# Altium schematic sheet 1_HV_POWER.schdoc
size 431 x 309 mm; Symbol: Sheet-Symbol_A3; Device: Sheet-Symbol_A3; @Page Name: HV_POWER copy; @Create Date: 2023-07-31; @Page Count: 4; @Page No: 1; @Project Name: DM lite opensource board A2A V1.0; @Schematic Name: HV582双路模块H7主控 copy; @Update Date: 2023-08-04; Company: 嘉立创EDA; Page Size: A3; Version: V1.0
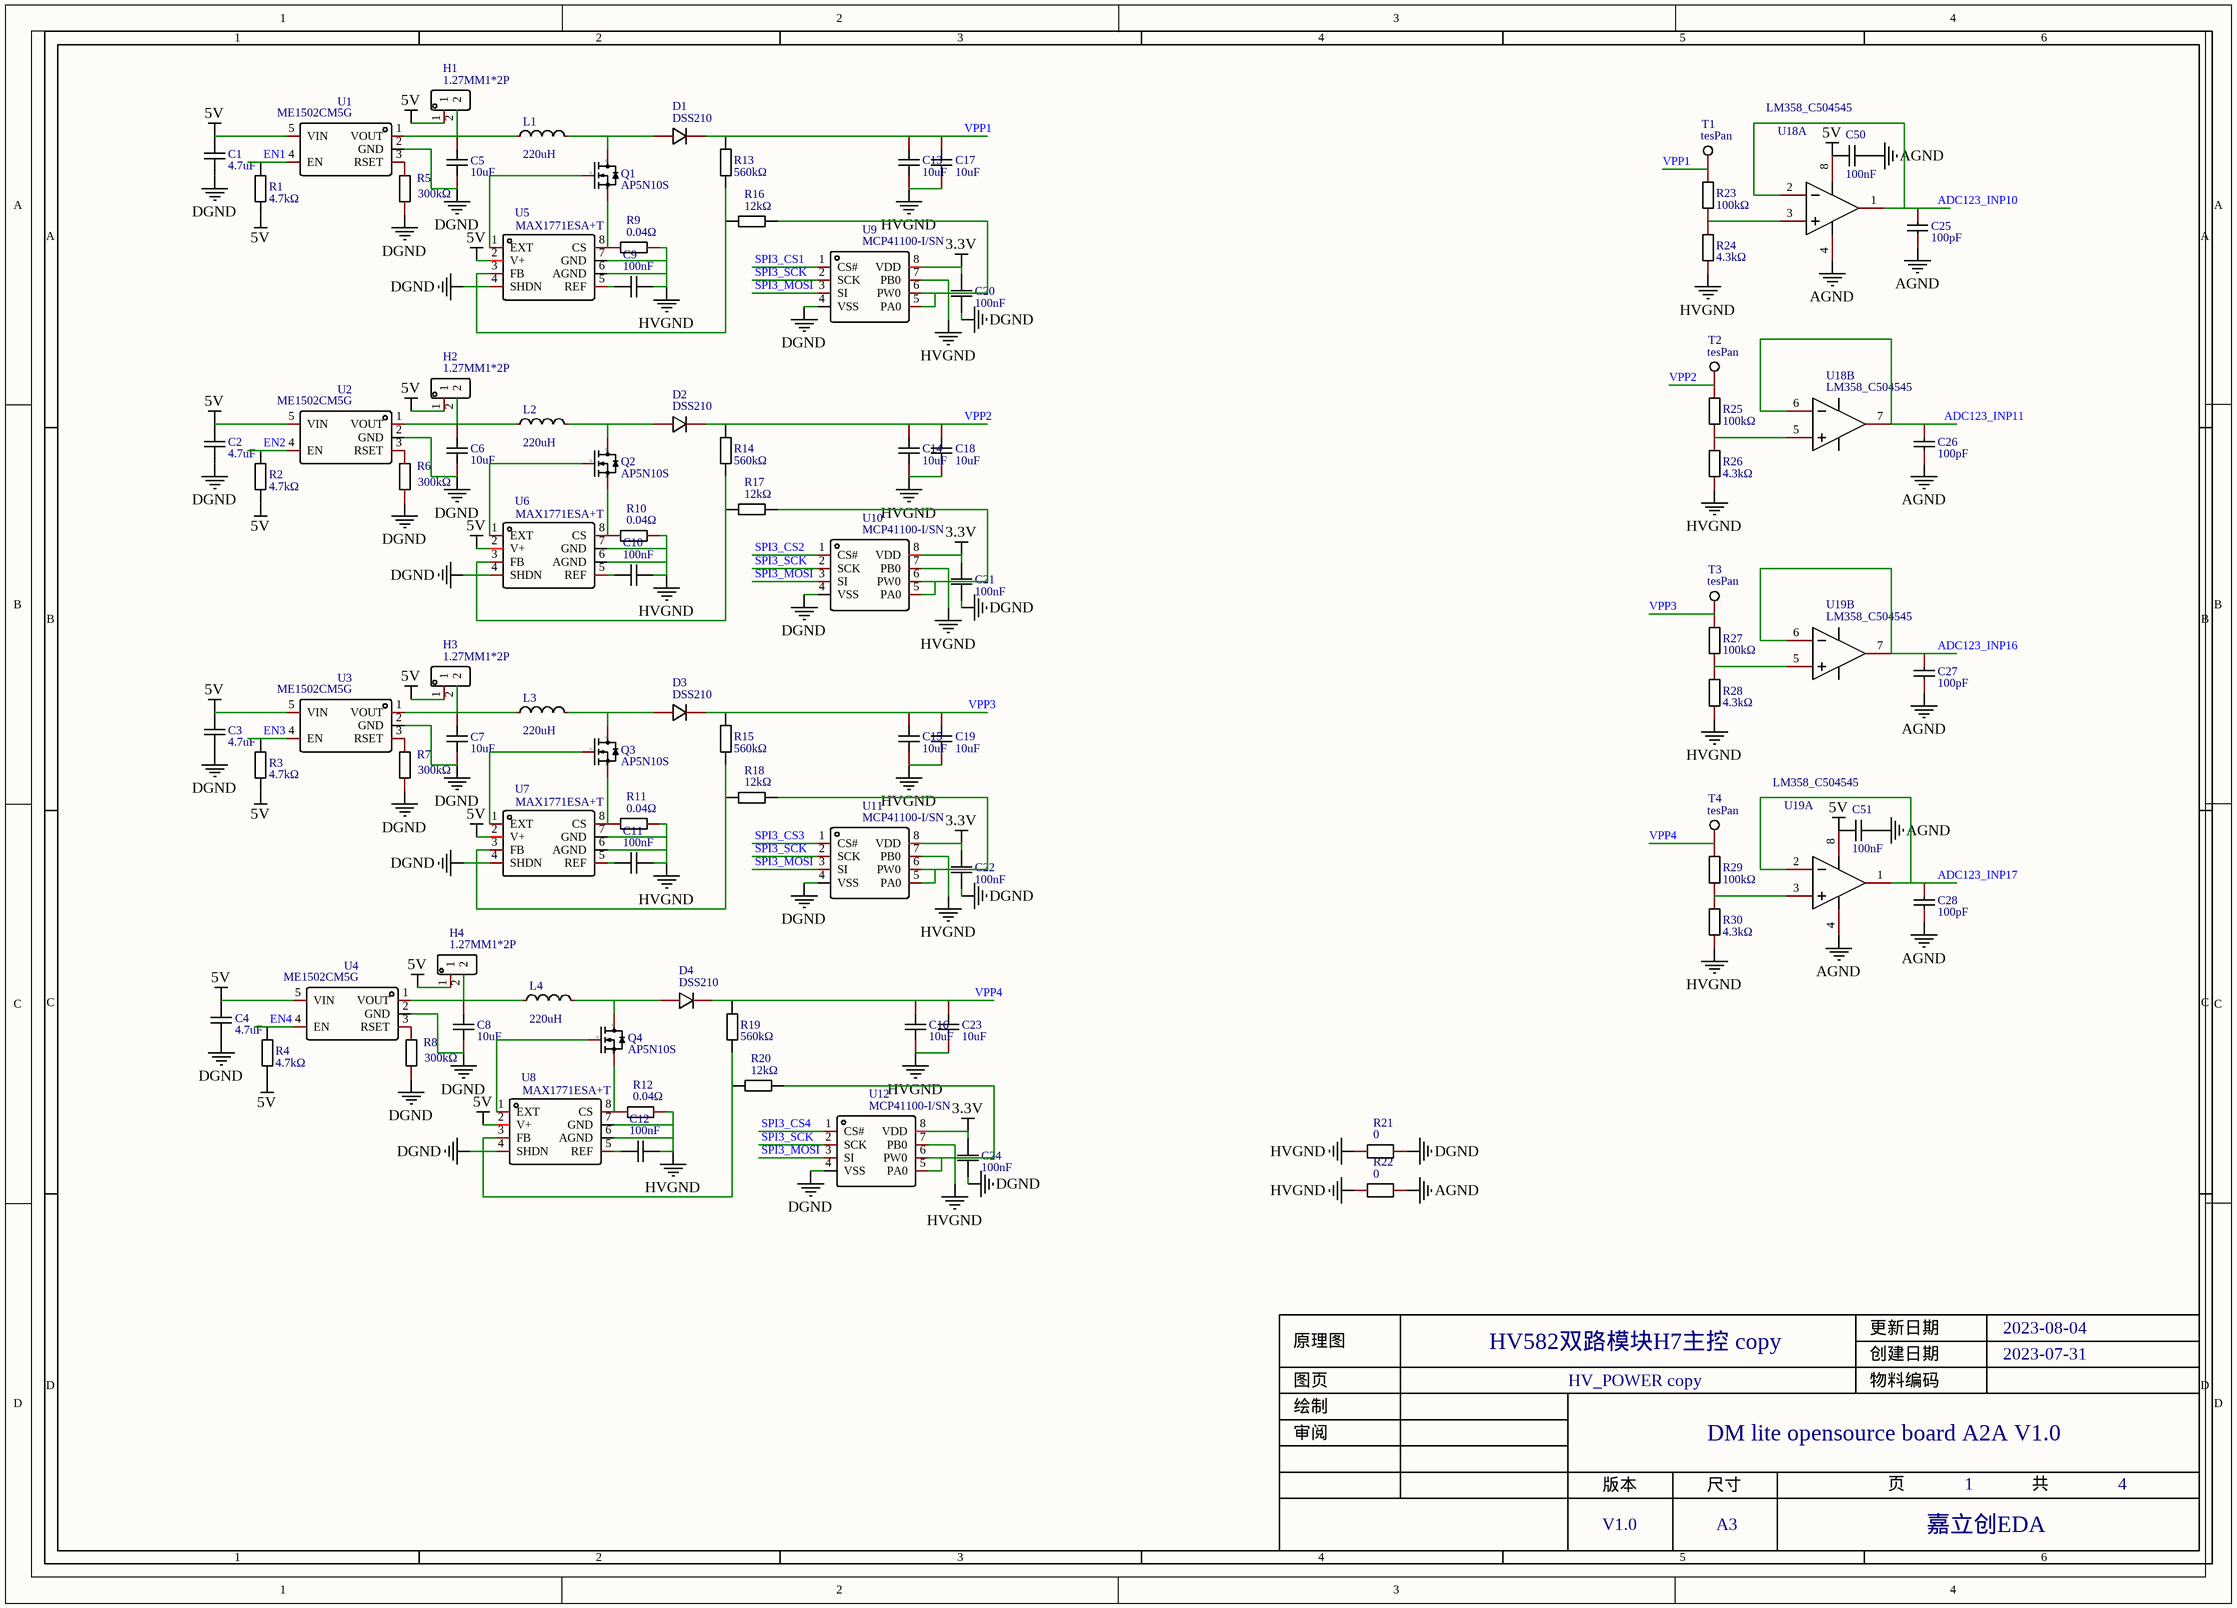
[diagram p0: 1_HV_POWER.schdoc]

## Parts
C1  4.7uF  [C0402]
C2  4.7uF  [C0402]
C3  4.7uF  [C0402]
C4  4.7uF  [C0402]
C5  10uF  [C0402]
C6  10uF  [C0402]
C7  10uF  [C0402]
C8  10uF  [C0402]
C9  100nF  [C0402_NEW]
C10  100nF  [C0402_NEW]
C11  100nF  [C0402_NEW]
C12  100nF  [C0402_NEW]
C13  10uF  [C1210]
C14  10uF  [C1210]
C15  10uF  [C1210]
C16  10uF  [C1210]
C17  10uF  [C1210]
C18  10uF  [C1210]
C19  10uF  [C1210]
C20  100nF  [C0402_NEW]
C21  100nF  [C0402_NEW]
C22  100nF  [C0402_NEW]
C23  10uF  [C1210]
C24  100nF  [C0402_NEW]
C25  100pF  [C0402]
C26  100pF  [C0402]
C27  100pF  [C0402]
C28  100pF  [C0402]
C50  100nF  [C0402_NEW]
C51  100nF  [C0402_NEW]
D1  DSS210  [SOD-123_L2.8-W1.8-LS3.7-FD]
D2  DSS210  [SOD-123_L2.8-W1.8-LS3.7-FD]
D3  DSS210  [SOD-123_L2.8-W1.8-LS3.7-FD]
D4  DSS210  [SOD-123_L2.8-W1.8-LS3.7-FD]
H1  1.27MM1*2P  [1.27MM1*2P]
H2  1.27MM1*2P  [1.27MM1*2P]
H3  1.27MM1*2P  [1.27MM1*2P]
H4  1.27MM1*2P  [1.27MM1*2P]
L1  value 220uH  [IND-SMD_L6.0-W6.0]  (hidden comment: YNR6045-221M)
L2  value 220uH  [IND-SMD_L6.0-W6.0]  (hidden comment: YNR6045-221M)
L3  value 220uH  [IND-SMD_L6.0-W6.0]  (hidden comment: YNR6045-221M)
L4  value 220uH  [IND-SMD_L6.0-W6.0]  (hidden comment: YNR6045-221M)
Q1  AP5N10S  [SOT-23-3_L2.9-W1.6-P1.90-LS2.8-BR]
Q2  AP5N10S  [SOT-23-3_L2.9-W1.6-P1.90-LS2.8-BR]
Q3  AP5N10S  [SOT-23-3_L2.9-W1.6-P1.90-LS2.8-BR]
Q4  AP5N10S  [SOT-23-3_L2.9-W1.6-P1.90-LS2.8-BR]
R1  4.7kΩ  [R0402]
R2  4.7kΩ  [R0402]
R3  4.7kΩ  [R0402]
R4  4.7kΩ  [R0402]
R5  300kΩ  [R0402]
R6  300kΩ  [R0402]
R7  300kΩ  [R0402]
R8  300kΩ  [R0402]
R9  0.04Ω  [R0805]
R10  0.04Ω  [R0805]
R11  0.04Ω  [R0805]
R12  0.04Ω  [R0805]
R13  560kΩ  [R0402]
R14  560kΩ  [R0402]
R15  560kΩ  [R0402]
R16  12kΩ  [R0402]
R17  12kΩ  [R0402]
R18  12kΩ  [R0402]
R19  560kΩ  [R0402]
R20  12kΩ  [R0402]
R21  0  [R0805]
R22  0  [R0805]
R23  100kΩ  [R0402]
R24  4.3kΩ  [R0402]
R25  100kΩ  [R0402]
R26  4.3kΩ  [R0402]
R27  100kΩ  [R0402]
R28  4.3kΩ  [R0402]
R29  100kΩ  [R0402]
R30  4.3kΩ  [R0402]
T1  tesPan  [测试点]
T2  tesPan  [测试点]
T3  tesPan  [测试点]
T4  tesPan  [测试点]
U1  ME1502CM5G  [SOT-23-5_L3.0-W1.5-P0.95-LS2.8-BL]
U2  ME1502CM5G  [SOT-23-5_L3.0-W1.5-P0.95-LS2.8-BL]
U3  ME1502CM5G  [SOT-23-5_L3.0-W1.5-P0.95-LS2.8-BL]
U4  ME1502CM5G  [SOT-23-5_L3.0-W1.5-P0.95-LS2.8-BL]
U5  MAX1771ESA+T  [SO-8_L4.9-W3.9-P1.27-LS5.9-BL]
U6  MAX1771ESA+T  [SO-8_L4.9-W3.9-P1.27-LS5.9-BL]
U7  MAX1771ESA+T  [SO-8_L4.9-W3.9-P1.27-LS5.9-BL]
U8  MAX1771ESA+T  [SO-8_L4.9-W3.9-P1.27-LS5.9-BL]
U9  MCP41100-I/SN  [SOIC-8_L4.9-W3.9-P1.27-LS6.0-BL]
U10  MCP41100-I/SN  [SOIC-8_L4.9-W3.9-P1.27-LS6.0-BL]
U11  MCP41100-I/SN  [SOIC-8_L4.9-W3.9-P1.27-LS6.0-BL]
U12  MCP41100-I/SN  [SOIC-8_L4.9-W3.9-P1.27-LS6.0-BL]
U18  LM358_C504545  [SOP-8_L4.9-W3.9-P1.27-LS6.0-BL]  (parts A,B of 2)
U19  LM358_C504545  [SOP-8_L4.9-W3.9-P1.27-LS6.0-BL]  (parts A,B of 2)

## Nets
3.3V: C20.1 C21.1 C22.1 C24.1 U9.8(VDD) U10.8(VDD) U11.8(VDD) U12.8(VDD)
5V: C1.2 C2.2 C3.2 C4.2 C50.1 C51.1 H1.1 H2.1 H3.1 H4.1 R1.2 R2.2 R3.2 R4.2 U1.5(VIN) U2.5(VIN) U3.5(VIN) U4.5(VIN) U5.2(V+) U6.2(V+) U7.2(V+) U8.2(V+) U18.8(VCC) U19.8(VCC)
AGND: C25.1 C26.1 C27.1 C28.1 C50.2 C51.2 R22.2 U18.4(GND) U19.4(GND)
DGND: C1.1 C2.1 C3.1 C4.1 C5.1 C6.1 C7.1 C8.1 C20.2 C21.2 C22.2 C24.2 R5.1 R6.1 R7.1 R8.1 R21.2 U1.2(GND) U2.2(GND) U3.2(GND) U4.2(GND) U5.4(SHDN) U6.4(SHDN) U7.4(SHDN) U8.4(SHDN) U9.4(VSS) U10.4(VSS) U11.4(VSS) U12.4(VSS)
HVGND: C9.1 C10.1 C11.1 C12.1 C13.1 C14.1 C15.1 C16.1 C17.1 C18.1 C19.1 C23.1 R9.2 R10.2 R11.2 R12.2 R21.1 R22.1 R24.1 R26.1 R28.1 R30.1 U5.6(AGND) U5.7(GND) U6.6(AGND) U6.7(GND) U7.6(AGND) U7.7(GND) U8.6(AGND) U8.7(GND) U9.7(PB0) U10.7(PB0) U11.7(PB0) U12.7(PB0)
ADC123_INP10: C25.2 U18.1(OUT1) U18.2(IN1-)
ADC123_INP11: C26.2 U18.6(IN2-) U18.7(OUT2)
ADC123_INP16: C27.2 U19.6(IN2-) U19.7(OUT2)
ADC123_INP17: C28.2 U19.1(OUT1) U19.2(IN1-)
EN1: R1.1 U1.4(EN)
EN2: R2.1 U2.4(EN)
EN3: R3.1 U3.4(EN)
EN4: R4.1 U4.4(EN)
SPI3_CS1: U9.1(CS#)
SPI3_CS2: U10.1(CS#)
SPI3_CS3: U11.1(CS#)
SPI3_CS4: U12.1(CS#)
SPI3_MOSI: U9.3(SI) U10.3(SI) U11.3(SI) U12.3(SI)
SPI3_SCK: U9.2(SCK) U10.2(SCK) U11.2(SCK) U12.2(SCK)
VPP1: C13.2 C17.2 D1.2(K) R13.2 R23.2 T1.1
VPP2: C14.2 C18.2 D2.2(K) R14.2 R25.2 T2.1
VPP3: C15.2 C19.2 D3.2(K) R15.2 R27.2 T3.1
VPP4: C16.2 C23.2 D4.2(K) R19.2 R29.2 T4.1
NetC5_2: C5.2 H1.2 L1.1 U1.1(VOUT)
NetC6_2: C6.2 H2.2 L2.1 U2.1(VOUT)
NetC7_2: C7.2 H3.2 L3.1 U3.1(VOUT)
NetC8_2: C8.2 H4.2 L4.1 U4.1(VOUT)
NetC9_2: C9.2 U5.5(REF)
NetC10_2: C10.2 U6.5(REF)
NetC11_2: C11.2 U7.5(REF)
NetC12_2: C12.2 U8.5(REF)
NetD1_1: D1.1(A) L1.2 Q1.3(D)
NetD2_1: D2.1(A) L2.2 Q2.3(D)
NetD3_1: D3.1(A) L3.2 Q3.3(D)
NetD4_1: D4.1(A) L4.2 Q4.3(D)
NetQ1_1: Q1.1(G) U5.1(EXT)
NetQ1_2: Q1.2(S) R9.1 U5.8(CS)
NetQ2_1: Q2.1(G) U6.1(EXT)
NetQ2_2: Q2.2(S) R10.1 U6.8(CS)
NetQ3_1: Q3.1(G) U7.1(EXT)
NetQ3_2: Q3.2(S) R11.1 U7.8(CS)
NetQ4_1: Q4.1(G) U8.1(EXT)
NetQ4_2: Q4.2(S) R12.1 U8.8(CS)
NetR5_2: R5.2 U1.3(RSET)
NetR6_2: R6.2 U2.3(RSET)
NetR7_2: R7.2 U3.3(RSET)
NetR8_2: R8.2 U4.3(RSET)
NetR13_1: R13.1 R16.1 U5.3(FB)
NetR14_1: R14.1 R17.1 U6.3(FB)
NetR15_1: R15.1 R18.1 U7.3(FB)
NetR16_2: R16.2 U9.5(PA0) U9.6(PW0)
NetR17_2: R17.2 U10.5(PA0) U10.6(PW0)
NetR18_2: R18.2 U11.5(PA0) U11.6(PW0)
NetR19_1: R19.1 R20.1 U8.3(FB)
NetR20_2: R20.2 U12.5(PA0) U12.6(PW0)
NetR23_1: R23.1 R24.2 U18.3(IN1+)
NetR25_1: R25.1 R26.2 U18.5(IN2+)
NetR27_1: R27.1 R28.2 U19.5(IN2+)
NetR29_1: R29.1 R30.2 U19.3(IN1+)

## Notes on the sheet
- 1
- 2
- 3
- 4
- 5
- 6
- A
- B
- C
- 原理图
- HV582双路模块H7主控 copy
- 创建日期
- 更新日期
- 2023-07-31
- 2023-08-04
- D
- 审阅
- 绘制
- 图页
- HV_POWER copy
- 物料编码
- DM lite opensource board A2A V1.0
- 版本
- 尺寸
- 页
- 共
- V1.0
- A3
- 嘉立创EDA

## Library data of the parts
C1 = 4.7uF: Manufacturer Part: CL05A475MP5NRNC; Manufacturer: SAMSUNG(三星); Convert to PCB: yes; Name: 4.7uF; Symbol: 4.7uF; Device: 4.7uF; Supplier: LCSC; Supplier Part: C23733; JLCPCB Part Class: Basic Part; Add into BOM: yes; Origin Footprint: C0402
C2-C4 = 4.7uF_C0402: Manufacturer Part: CL05A475MP5NRNC; Manufacturer: SAMSUNG(三星); Convert to PCB: yes; Name: 4.7uF; Symbol: 4.7uF; Device: 4.7uF_C0402; Supplier: LCSC; Supplier Part: C23733; JLCPCB Part Class: Basic Part; Add into BOM: yes; Origin Footprint: C0402
C5-C8 = 10uF_C0402: Manufacturer: Samsung Electro-Mechanics; Manufacturer Part: CL05A106MP5NUNC; Symbol: 10uF(1); Convert to PCB: yes; Name: 10uF; Device: 10uF_C0402; Supplier: LCSC; Supplier Part: C315248; JLCPCB Part Class: Extended Part; Add into BOM: yes; Origin Footprint: C0402
C9-C12 C20-C22 C24 C50 C51 = 100nF_C0402_NEW: Manufacturer Part: CL05B104KO5NNNC; Manufacturer: SAMSUNG; Convert to PCB: yes; Name: 100nF; Symbol: 100nF; Device: 100nF_C0402_NEW; Supplier: LCSC; Supplier Part: C1525; JLCPCB Part Class: Basic Part; Add into BOM: yes; Origin Footprint: C0402_NEW
C13-C19 C23 = 10uF_C1210: Manufacturer: SANYEAR(叁叶源); Manufacturer Part: C1210X7R106K101NT; Symbol: 10uF(1); Convert to PCB: yes; Name: 10uF; Device: 10uF_C1210; Supplier: LCSC; Supplier Part: C2844385; JLCPCB Part Class: Extended Part; Add into BOM: yes; Origin Footprint: C1210
C25-C28 = 0402CG101J500NT: Manufacturer: FH; Convert to PCB: yes; Name: 100pF; Symbol: 100pF; Device: 0402CG101J500NT; Supplier: LCSC; Manufacturer Part: 0402CG101J500NT; Supplier Part: C1546; JLCPCB Part Class: Basic Part; Add into BOM: yes; Origin Footprint: C0402
D1 = DSS210: Manufacturer: Bourne Semicon (Shenzhen); Convert to PCB: yes; Name: DSS210; Symbol: DSS210; Device: DSS210; Supplier: LCSC; Supplier Part: C511868; Manufacturer Part: DSS210; JLCPCB Part Class: Extended Part; Add into BOM: yes; Origin Footprint: SOD-123_L2.8-W1.8-LS3.7-FD
D2-D4 = DSS210_SOD-123_L2.8-W1.8-LS3.7-FD: Manufacturer: Bourne Semicon (Shenzhen); Convert to PCB: yes; Name: DSS210; Symbol: DSS210; Device: DSS210_SOD-123_L2.8-W1.8-LS3.7-FD; Supplier: LCSC; Supplier Part: C511868; Manufacturer Part: DSS210; JLCPCB Part Class: Extended Part; Add into BOM: yes; Origin Footprint: SOD-123_L2.8-W1.8-LS3.7-FD
H1 = 1.27MM1*2P: Manufacturer: ReliaPro; Manufacturer Part: 1.27mm1*12P Straight Headers  Pins; Convert to PCB: yes; Name: 1.27MM1*2P; Symbol: 1.27MM1*2P; Device: 1.27MM1*2P; Supplier Part: C28953; Supplier: LCSC; image: http://image.lceda.cn/szlcsc/C28953.jpg; Add into BOM: yes; Origin Footprint: 1.27MM1*2P
H2-H4 = 1.27MM1*2P_1.27MM1*2P: Manufacturer: ReliaPro; Manufacturer Part: 1.27mm1*12P Straight Headers  Pins; Convert to PCB: yes; Name: 1.27MM1*2P; Symbol: 1.27MM1*2P; Device: 1.27MM1*2P_1.27MM1*2P; Supplier Part: C28953; Supplier: LCSC; image: http://image.lceda.cn/szlcsc/C28953.jpg; Add into BOM: yes; Origin Footprint: 1.27MM1*2P
L1-L4 = YNR6045-221M: 电感值:220uH;精度:±20%;额定电流:590mA;; Manufacturer: YJYCOIN(益嘉源); Add into BOM: yes; Tolerance: ±20%; Rated Current: 590mA; DC Resistance (DCR): 834mΩ; Name: 220uH; Symbol: YNR6045-221M; Device: YNR6045-221M; LCSC Part Name: 220uH ±20% 590mA 834mΩ; Supplier Part: C497842; Manufacturer Part: YNR6045-221M; Supplier Footprint: SMD,6x6mm; JLCPCB Part Class: 扩展库; Datasheet: https://atta.szlcsc.com/upload/public/pdf/source/20200317/C497838_ADAADDA66AFC043F2D8B9A62FB946728.pdf; Supplier: LCSC; Convert to PCB: yes
Q1 = AP5N10S: Manufacturer: ALLPOWER(铨力); Convert to PCB: yes; Name: AP5N10S; Symbol: AP5N10S; Device: AP5N10S; Supplier: LCSC; Supplier Part: C2849571; Manufacturer Part: AP5N10S; JLCPCB Part Class: Extended Part; Add into BOM: yes; Origin Footprint: SOT-23-3_L2.9-W1.6-P1.90-LS2.8-BR
Q2-Q4 = AP5N10S_SOT-23-3_L2.9-W1.6-P1.90-LS2.8-BR: Manufacturer: ALLPOWER(铨力); Convert to PCB: yes; Name: AP5N10S; Symbol: AP5N10S; Device: AP5N10S_SOT-23-3_L2.9-W1.6-P1.90-LS2.8-BR; Supplier: LCSC; Supplier Part: C2849571; Manufacturer Part: AP5N10S; JLCPCB Part Class: Extended Part; Add into BOM: yes; Origin Footprint: SOT-23-3_L2.9-W1.6-P1.90-LS2.8-BR
R1 = 4.7kΩ: Manufacturer: UNI-ROYAL(厚声); Manufacturer Part: 0402WGF4701TCE; Resistance: 4.7K; Convert to PCB: yes; Name: 4.7kΩ; Symbol: 4.7kΩ; Device: 4.7kΩ; Supplier: LCSC; Supplier Part: C25900; JLCPCB Part Class: Basic Part; Add into BOM: yes; Origin Footprint: R0402
R2-R4 = 4.7kΩ_R0402: Manufacturer: UNI-ROYAL(厚声); Manufacturer Part: 0402WGF4701TCE; Resistance: 4.7K; Convert to PCB: yes; Name: 4.7kΩ; Symbol: 4.7kΩ; Device: 4.7kΩ_R0402; Supplier: LCSC; Supplier Part: C25900; JLCPCB Part Class: Basic Part; Add into BOM: yes; Origin Footprint: R0402
R5-R8 = 0402WGF3003TCE: 电阻类型:厚膜电阻;阻值:300kΩ;精度:±1%;功率:62.5mW;温度系数:±100ppm/℃;最大工作电压:50V;工作温度范围:-55℃~+155℃;; Manufacturer: UNI-ROYAL(厚声); Add into BOM: yes; Tolerance: ±1%; Power(Watts): 62.5mW; Overload Voltage (Max): 50V; Name: 300kΩ; Symbol: 0402WGF3003TCE; Device: 0402WGF3003TCE; LCSC Part Name: 300kΩ ±1% 62.5mW; Supplier Part: C25774; Manufacturer Part: 0402WGF3003TCE; Supplier Footprint: 0402; JLCPCB Part Class: 基础库; Datasheet: https://atta.szlcsc.com/upload/public/pdf/source/20200306/C422600_1E6D84923E4A46A82E41ADD87F860B5C.pdf; Supplier: LCSC; Convert to PCB: yes; Type: 厚膜电阻; Value: 300kΩ; Temperature Coefficient: ±100ppm/℃; Operating Temperature Range: -55℃~+155℃
R9 = 0.04Ω: Manufacturer: Walter Elec; Manufacturer Part: STE0805MW75R040F; Resistance: 0.04; Convert to PCB: yes; Name: 0.04Ω; Symbol: 0.04Ω; Device: 0.04Ω; Supplier: LCSC; Supplier Part: C201265; JLCPCB Part Class: Extended Part; Add into BOM: yes; Origin Footprint: R0805
R10-R12 = 0.04Ω_R0805: Manufacturer: Walter Elec; Manufacturer Part: STE0805MW75R040F; Resistance: 0.04; Convert to PCB: yes; Name: 0.04Ω; Symbol: 0.04Ω; Device: 0.04Ω_R0805; Supplier: LCSC; Supplier Part: C201265; JLCPCB Part Class: Extended Part; Add into BOM: yes; Origin Footprint: R0805
R13 = 560kΩ: Manufacturer: UNI-ROYAL(厚声); Manufacturer Part: 0402WGF5603TCE; Resistance: 560K; Convert to PCB: yes; Name: 560kΩ; Symbol: 560kΩ; Device: 560kΩ; Supplier: LCSC; Supplier Part: C132339; JLCPCB Part Class: Extended Part; Add into BOM: yes; Origin Footprint: R0402
R14 R15 R19 = 560kΩ_R0402: Manufacturer: UNI-ROYAL(厚声); Manufacturer Part: 0402WGF5603TCE; Resistance: 560K; Convert to PCB: yes; Name: 560kΩ; Symbol: 560kΩ; Device: 560kΩ_R0402; Supplier: LCSC; Supplier Part: C132339; JLCPCB Part Class: Extended Part; Add into BOM: yes; Origin Footprint: R0402
R16 = 12kΩ: Manufacturer: UniOhm; Manufacturer Part: 0402WGF1202TCE; Resistance: 12K; Convert to PCB: yes; Name: 12kΩ; Symbol: 12kΩ; Device: 12kΩ; Supplier: LCSC; Supplier Part: C25752; JLCPCB Part Class: Basic Part; Add into BOM: yes; Origin Footprint: R0402
R17 R18 R20 = 12kΩ_R0402: Manufacturer: UniOhm; Manufacturer Part: 0402WGF1202TCE; Resistance: 12K; Convert to PCB: yes; Name: 12kΩ; Symbol: 12kΩ; Device: 12kΩ_R0402; Supplier: LCSC; Supplier Part: C25752; JLCPCB Part Class: Basic Part; Add into BOM: yes; Origin Footprint: R0402
R21 R22 = 0: Convert to PCB: yes; Name: 0; Symbol: 0; Device: 0; Add into BOM: yes; Origin Footprint: R0805
R23 R25 R27 R29 = 0402WGF1003TCE: Manufacturer: UniOhm; Resistance: 100K; Convert to PCB: yes; Name: 100kΩ; Symbol: 100kΩ; Device: 0402WGF1003TCE; Supplier: LCSC; Manufacturer Part: 0402WGF1003TCE; Supplier Part: C25741; JLCPCB Part Class: Basic Part; Add into BOM: yes; Origin Footprint: R0402
R24 R26 R28 R30 = 0402WGJ0432TCE: Manufacturer: UniOhm; Resistance: 4.3K; Convert to PCB: yes; Name: 4.3kΩ; Symbol: 4.3kΩ; Device: 0402WGJ0432TCE; Supplier: LCSC; Manufacturer Part: 0402WGJ0432TCE; Supplier Part: C25939; JLCPCB Part Class: Extended Part; Add into BOM: yes; Origin Footprint: R0402
T1-T4 = tesPan: Convert to PCB: yes; Name: tesPan; Symbol: tesPan; Device: tesPan; Supplier Part: undefined; Add into BOM: yes; Origin Footprint: 测试点
U1 = ME1502CM5G: Manufacturer: MICRONE(南京微盟); Convert to PCB: yes; Name: ME1502CM5G; Symbol: ME1502CM5G; Device: ME1502CM5G; Supplier: LCSC; Supplier Part: C2932929; Manufacturer Part: ME1502CM5G; JLCPCB Part Class: Extended Part; Add into BOM: yes; Origin Footprint: SOT-23-5_L3.0-W1.5-P0.95-LS2.8-BL
U2-U4 = ME1502CM5G_SOT-23-5_L3.0-W1.5-P0.95-LS2.8-BL: Manufacturer: MICRONE(南京微盟); Convert to PCB: yes; Name: ME1502CM5G; Symbol: ME1502CM5G; Device: ME1502CM5G_SOT-23-5_L3.0-W1.5-P0.95-LS2.8-BL; Supplier: LCSC; Supplier Part: C2932929; Manufacturer Part: ME1502CM5G; JLCPCB Part Class: Extended Part; Add into BOM: yes; Origin Footprint: SOT-23-5_L3.0-W1.5-P0.95-LS2.8-BL
U5 = MAX1771ESA+T: Manufacturer: Maxim Integrated; Convert to PCB: yes; Name: MAX1771ESA+T; Symbol: MAX1771ESA+T; Device: MAX1771ESA+T; Supplier: LCSC; Supplier Part: C407903; Manufacturer Part: MAX1771ESA+T; Add into BOM: yes; Origin Footprint: SO-8_L4.9-W3.9-P1.27-LS5.9-BL
U6-U8 = MAX1771ESA+T_SO-8_L4.9-W3.9-P1.27-LS5.9-BL: Manufacturer: Maxim Integrated; Convert to PCB: yes; Name: MAX1771ESA+T; Symbol: MAX1771ESA+T; Device: MAX1771ESA+T_SO-8_L4.9-W3.9-P1.27-LS5.9-BL; Supplier: LCSC; Supplier Part: C407903; Manufacturer Part: MAX1771ESA+T; Add into BOM: yes; Origin Footprint: SO-8_L4.9-W3.9-P1.27-LS5.9-BL
U9 = MCP41100-I/SN: Manufacturer: MICROCHIP; Paste Type: expand; Convert to PCB: yes; Name: MCP41100-I/SN; Symbol: MCP41100-I/SN; Device: MCP41100-I/SN; Supplier: LCSC; Manufacturer Part: MCP41100-I/SN; image: //image.lceda.cn/szlcsc/C56660.jpg; Supplier Part: C56660; Assembly Type: smtWeld; Add into BOM: yes; Origin Footprint: SOIC-8_L4.9-W3.9-P1.27-LS6.0-BL
U10-U12 = MCP41100-I/SN_SOIC-8_L4.9-W3.9-P1.27-LS6.0-BL: Manufacturer: MICROCHIP; Paste Type: expand; Convert to PCB: yes; Name: MCP41100-I/SN; Symbol: MCP41100-I/SN; Device: MCP41100-I/SN_SOIC-8_L4.9-W3.9-P1.27-LS6.0-BL; Supplier: LCSC; Manufacturer Part: MCP41100-I/SN; image: //image.lceda.cn/szlcsc/C56660.jpg; Supplier Part: C56660; Assembly Type: smtWeld; Add into BOM: yes; Origin Footprint: SOIC-8_L4.9-W3.9-P1.27-LS6.0-BL
U18 U19 = LM358: Manufacturer: Gcore; Convert to PCB: yes; Name: LM358_C504545; Symbol: LM358_C504545; Device: LM358; Supplier: LCSC; Supplier Part: C504545; Manufacturer Part: LM358; JLCPCB Part Class: Extended Part; Add into BOM: yes; Origin Footprint: SOP-8_L4.9-W3.9-P1.27-LS6.0-BL